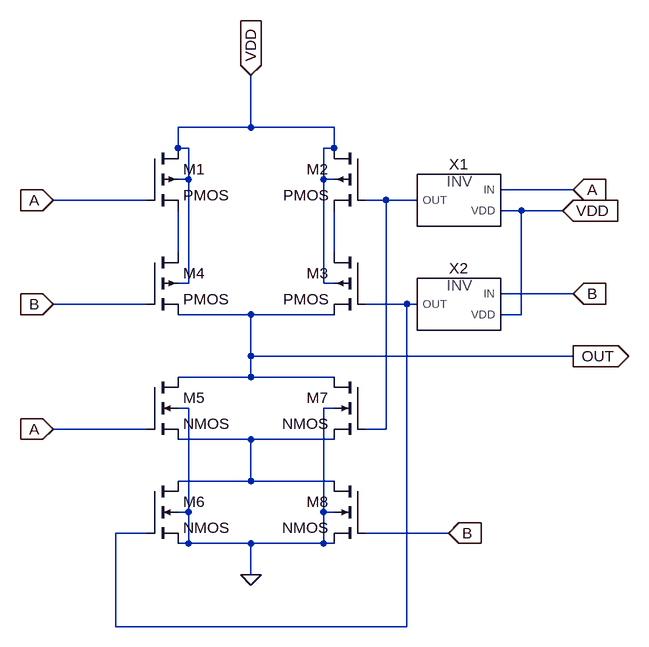
[diagram p0: schematic XnorCMOS.asc]
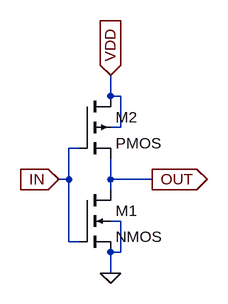
[diagram p1: sub-circuit invcmos.asc]
XnorCMOS.asc, the LTspice schematic file:
Version 4
SHEET 1 880 756
WIRE 224 -16 224 -96
WIRE 224 -16 112 -16
WIRE 352 -16 224 -16
WIRE 112 16 112 -16
WIRE 128 16 112 16
WIRE 352 16 352 -16
WIRE 352 16 336 16
WIRE 128 64 128 16
WIRE 128 64 112 64
WIRE 336 64 336 16
WIRE 352 64 336 64
WIRE 720 80 608 80
WIRE 64 96 -80 96
WIRE 432 96 400 96
WIRE 480 96 432 96
WIRE 640 112 608 112
WIRE 704 112 640 112
WIRE 112 176 112 112
WIRE 352 176 352 112
WIRE 128 224 128 64
WIRE 128 224 112 224
WIRE 336 224 336 64
WIRE 352 224 336 224
WIRE 720 240 608 240
WIRE 64 256 -80 256
WIRE 464 256 400 256
WIRE 480 256 464 256
WIRE 224 272 112 272
WIRE 352 272 224 272
WIRE 640 272 640 112
WIRE 640 272 608 272
WIRE 224 336 224 272
WIRE 720 336 224 336
WIRE 224 368 224 336
WIRE 224 368 112 368
WIRE 352 368 224 368
WIRE 128 416 112 416
WIRE 352 416 336 416
WIRE 64 448 -80 448
WIRE 432 448 432 96
WIRE 432 448 400 448
WIRE 224 464 112 464
WIRE 352 464 224 464
WIRE 224 528 224 464
WIRE 224 528 112 528
WIRE 352 528 224 528
WIRE 128 576 128 416
WIRE 128 576 112 576
WIRE 336 576 336 416
WIRE 352 576 336 576
WIRE 64 608 16 608
WIRE 528 608 400 608
WIRE 128 624 128 576
WIRE 128 624 112 624
WIRE 224 624 128 624
WIRE 336 624 336 576
WIRE 336 624 224 624
WIRE 352 624 336 624
WIRE 224 672 224 624
WIRE 16 752 16 608
WIRE 464 752 464 256
WIRE 464 752 16 752
FLAG 224 672 0
FLAG 224 -96 VDD
IOPIN 224 -96 In
FLAG -80 96 A
IOPIN -80 96 In
FLAG -80 256 B
IOPIN -80 256 In
FLAG 720 80 A
IOPIN 720 80 In
FLAG 720 240 B
IOPIN 720 240 In
FLAG -80 448 A
IOPIN -80 448 In
FLAG 704 112 VDD
IOPIN 704 112 In
FLAG 528 608 B
IOPIN 528 608 In
FLAG 720 336 OUT
IOPIN 720 336 Out
SYMBOL pmos4 64 16 R0
SYMATTR InstName M1
SYMATTR Value2 l=65nm w=162.5nm
SYMBOL pmos4 400 16 M0
SYMATTR InstName M2
SYMATTR Value2 l=65nm w=162.5nm
SYMBOL pmos4 400 176 M0
SYMATTR InstName M3
SYMATTR Value2 l=65nm w=162.5nm
SYMBOL pmos4 64 176 R0
SYMATTR InstName M4
SYMATTR Value2 l=65nm w=162.5nm
SYMBOL nmos4 64 368 R0
SYMATTR InstName M5
SYMATTR Value2 l=65nm w=65nm
SYMBOL nmos4 64 528 R0
SYMATTR InstName M6
SYMATTR Value2 l=65nm w=65nm
SYMBOL nmos4 400 368 M0
SYMATTR InstName M7
SYMATTR Value2 l=65nm w=65nm
SYMBOL nmos4 400 528 M0
SYMATTR InstName M8
SYMATTR Value2 l=65nm w=65nm
SYMBOL InvCMOS 544 96 M0
SYMATTR InstName X1
SYMBOL InvCMOS 544 256 M0
SYMATTR InstName X2

invcmos.asc, the sub-circuit schematic file:
Version 4
SHEET 1 880 680
WIRE 208 32 208 0
WIRE 224 32 208 32
WIRE 224 80 224 32
WIRE 224 80 208 80
WIRE 160 112 144 112
WIRE 144 160 144 112
WIRE 144 160 128 160
WIRE 208 160 208 128
WIRE 272 160 208 160
WIRE 208 176 208 160
WIRE 224 224 208 224
WIRE 144 256 144 160
WIRE 160 256 144 256
WIRE 224 272 224 224
WIRE 224 272 208 272
WIRE 208 304 208 272
FLAG 208 304 0
FLAG 208 0 VDD
IOPIN 208 0 In
FLAG 128 160 IN
IOPIN 128 160 In
FLAG 272 160 OUT
IOPIN 272 160 Out
SYMBOL nmos4 160 176 R0
SYMATTR InstName M1
SYMATTR Value2 l=65nm w=65nm
SYMBOL pmos4 160 32 R0
SYMATTR InstName M2
SYMATTR Value2 l=65nm w=162.5nm

The netlist it stands for:
* XnorCMOS.asc
M1 VDD A N002 VDD PMOS l=65nm w=162.5nm
M2 VDD N001 N003 VDD PMOS l=65nm w=162.5nm
M3 N003 N004 OUT VDD PMOS l=65nm w=162.5nm
M4 N002 B OUT VDD PMOS l=65nm w=162.5nm
M5 OUT A N005 0 NMOS l=65nm w=65nm
M6 N005 N004 0 0 NMOS l=65nm w=65nm
M7 OUT N001 N005 0 NMOS l=65nm w=65nm
M8 N005 B 0 0 NMOS l=65nm w=65nm
XX1 A VDD N001 invcmos
XX2 B VDD N004 invcmos

* block symbol definitions
.subckt invcmos IN VDD OUT
M1 OUT IN 0 0 NMOS l=65nm w=65nm
M2 VDD IN OUT VDD PMOS l=65nm w=162.5nm
.ends invcmos

.model NMOS NMOS
.model PMOS PMOS
.lib standard.mos
.backanno
.end